# Altium schematic sheet FPGA.SchDoc
size A3
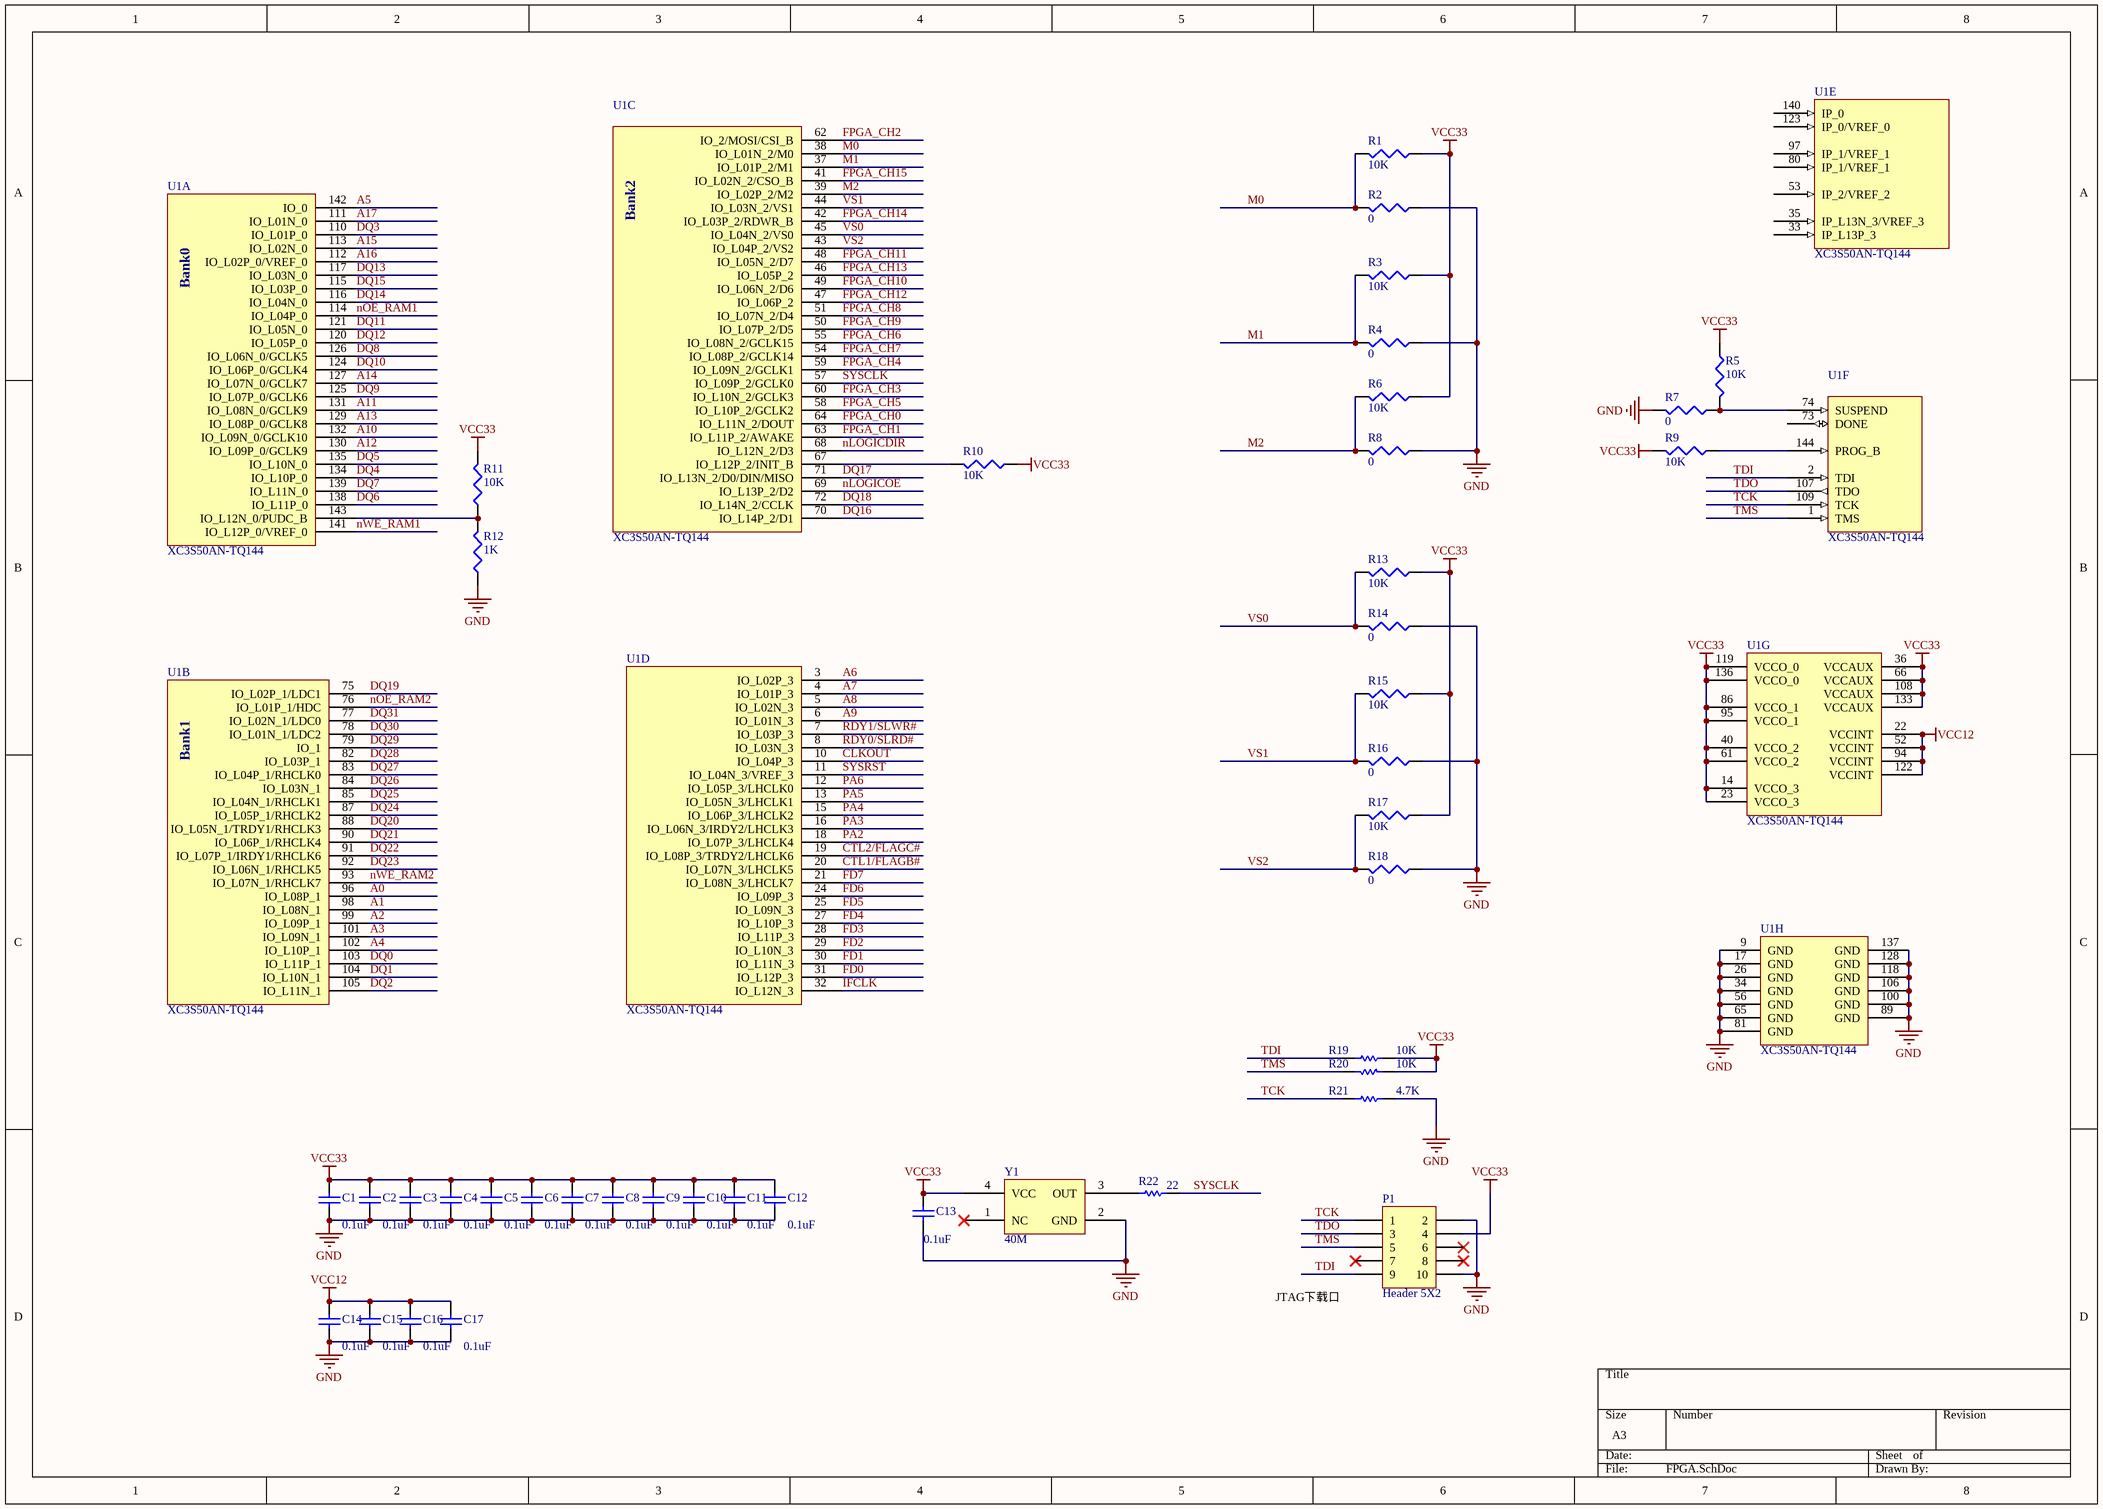
[diagram p0: FPGA.SchDoc]

## Parts
C1  value 0.1uF  [cc0603]
C2  value 0.1uF  [cc0603]
C3  value 0.1uF  [cc0603]
C4  value 0.1uF  [cc0603]
C5  value 0.1uF  [cc0603]
C6  value 0.1uF  [cc0603]
C7  value 0.1uF  [cc0603]
C8  value 0.1uF  [cc0603]
C9  value 0.1uF  [cc0603]
C10  value 0.1uF  [cc0603]
C11  value 0.1uF  [cc0603]
C12  value 0.1uF  [cc0603]
C13  value 0.1uF  [cc0603]
C14  value 0.1uF  [cc0603]
C15  value 0.1uF  [cc0603]
C16  value 0.1uF  [cc0603]
C17  value 0.1uF  [cc0603]
P1  Header 5X2  [HDR2X5]
R1  value 10K  [CR0603]
R2  value 0  [CR0603]
R3  value 10K  [CR0603]
R4  value 0  [CR0603]
R5  value 10K  [CR0603]
R6  value 10K  [CR0603]
R7  value 0  [CR0603]
R8  value 0  [CR0603]
R9  value 10K  [CR0603]
R10  value 10K  [CR0603]
R11  value 10K  [CR0603]
R12  value 1K  [CR0603]
R13  value 10K  [CR0603]
R14  value 0  [CR0603]
R15  value 10K  [CR0603]
R16  value 0  [CR0603]
R17  value 10K  [CR0603]
R18  value 0  [CR0603]
R19  value 10K  [CR0603]  (hidden comment: Res1)
R20  value 10K  [CR0603]  (hidden comment: Res1)
R21  value 4.7K  [CR0603]  (hidden comment: Res1)
R22  value 22  [CR0603]  (hidden comment: Res1)
U1  XC3S50AN-TQ144  [EP2C8T144]  (parts A,B,C,D,E,F,G,H of 8)
Y1  40M  [jing_zhen(you yuan)]

## Nets
GND: C1.1 C2.1 C3.1 C4.1 C5.1 C6.1 C7.1 C8.1 C9.1 C10.1 C11.1 C12.1 C13.1 C14.1 C15.1 C16.1 C17.1 P1.2 P1.10 R2.1 R4.1 R7.2 R8.1 R12.1 R14.1 R16.1 R18.1 R21.1 U1.9(GND) U1.17(GND) U1.26(GND) U1.34(GND) U1.56(GND) U1.65(GND) U1.81(GND) U1.89(GND) U1.100(GND) U1.106(GND) U1.118(GND) U1.128(GND) U1.137(GND) Y1.2(GND)
VCC12: C14.2 C15.2 C16.2 C17.2 U1.22(VCCINT) U1.52(VCCINT) U1.94(VCCINT) U1.122(VCCINT)
VCC33: C1.2 C2.2 C3.2 C4.2 C5.2 C6.2 C7.2 C8.2 C9.2 C10.2 C11.2 C12.2 C13.2 P1.4 R1.1 R3.1 R5.1 R6.1 R9.2 R10.1 R11.2 R13.1 R15.1 R17.1 R19.1 R20.1 U1.14(VCCO_3) U1.23(VCCO_3) U1.36(VCCAUX) U1.40(VCCO_2) U1.61(VCCO_2) U1.66(VCCAUX) U1.86(VCCO_1) U1.95(VCCO_1) U1.108(VCCAUX) U1.119(VCCO_0) U1.133(VCCAUX) U1.136(VCCO_0) Y1.4(VCC)
A0: U1.96(IO_L08P_1)
A1: U1.98(IO_L08N_1)
A2: U1.99(IO_L09P_1)
A3: U1.101(IO_L09N_1)
A4: U1.102(IO_L10P_1)
A5: U1.142(IO_0)
A6: U1.3(IO_L02P_3)
A7: U1.4(IO_L01P_3)
A8: U1.5(IO_L02N_3)
A9: U1.6(IO_L01N_3)
A10: U1.132(IO_L09N_0/GCLK10)
A11: U1.131(IO_L08N_0/GCLK9)
A12: U1.130(IO_L09P_0/GCLK9)
A13: U1.129(IO_L08P_0/GCLK8)
A14: U1.127(IO_L07N_0/GCLK7)
A15: U1.113(IO_L02N_0)
A16: U1.112(IO_L02P_0/VREF_0)
A17: U1.111(IO_L01N_0)
CLKOUT: U1.10(IO_L04P_3)
CTL1/FLAGB#: U1.20(IO_L07N_3/LHCLK5)
CTL2/FLAGC#: U1.19(IO_L08P_3/TRDY2/LHCLK6)
DQ0: U1.103(IO_L11P_1)
DQ1: U1.104(IO_L10N_1)
DQ2: U1.105(IO_L11N_1)
DQ3: U1.110(IO_L01P_0)
DQ4: U1.134(IO_L10P_0)
DQ5: U1.135(IO_L10N_0)
DQ6: U1.138(IO_L11P_0)
DQ7: U1.139(IO_L11N_0)
DQ8: U1.126(IO_L06N_0/GCLK5)
DQ9: U1.125(IO_L07P_0/GCLK6)
DQ10: U1.124(IO_L06P_0/GCLK4)
DQ11: U1.121(IO_L05N_0)
DQ12: U1.120(IO_L05P_0)
DQ13: U1.117(IO_L03N_0)
DQ14: U1.116(IO_L04N_0)
DQ15: U1.115(IO_L03P_0)
DQ16: U1.70(IO_L14P_2/D1)
DQ17: U1.71(IO_L13N_2/D0/DIN/MISO)
DQ18: U1.72(IO_L14N_2/CCLK)
DQ19: U1.75(IO_L02P_1/LDC1)
DQ20: U1.88(IO_L05N_1/TRDY1/RHCLK3)
DQ21: U1.90(IO_L06P_1/RHCLK4)
DQ22: U1.91(IO_L07P_1/IRDY1/RHCLK6)
DQ23: U1.92(IO_L06N_1/RHCLK5)
DQ24: U1.87(IO_L05P_1/RHCLK2)
DQ25: U1.85(IO_L04N_1/RHCLK1)
DQ26: U1.84(IO_L03N_1)
DQ27: U1.83(IO_L04P_1/RHCLK0)
DQ28: U1.82(IO_L03P_1)
DQ29: U1.79(IO_1)
DQ30: U1.78(IO_L01N_1/LDC2)
DQ31: U1.77(IO_L02N_1/LDC0)
FD0: U1.31(IO_L12P_3)
FD1: U1.30(IO_L11N_3)
FD2: U1.29(IO_L10N_3)
FD3: U1.28(IO_L11P_3)
FD4: U1.27(IO_L10P_3)
FD5: U1.25(IO_L09N_3)
FD6: U1.24(IO_L09P_3)
FD7: U1.21(IO_L08N_3/LHCLK7)
FPGA_CH0: U1.64(IO_L11N_2/DOUT)
FPGA_CH1: U1.63(IO_L11P_2/AWAKE)
FPGA_CH2: U1.62(IO_2/MOSI/CSI_B)
FPGA_CH3: U1.60(IO_L10N_2/GCLK3)
FPGA_CH4: U1.59(IO_L09N_2/GCLK1)
FPGA_CH5: U1.58(IO_L10P_2/GCLK2)
FPGA_CH6: U1.55(IO_L08N_2/GCLK15)
FPGA_CH7: U1.54(IO_L08P_2/GCLK14)
FPGA_CH8: U1.51(IO_L07N_2/D4)
FPGA_CH9: U1.50(IO_L07P_2/D5)
FPGA_CH10: U1.49(IO_L06N_2/D6)
FPGA_CH11: U1.48(IO_L05N_2/D7)
FPGA_CH12: U1.47(IO_L06P_2)
FPGA_CH13: U1.46(IO_L05P_2)
FPGA_CH14: U1.42(IO_L03P_2/RDWR_B)
FPGA_CH15: U1.41(IO_L02N_2/CSO_B)
IFCLK: U1.32(IO_L12N_3)
M0: R1.2 R2.2 U1.38(IO_L01N_2/M0)
M1: R3.2 R4.2 U1.37(IO_L01P_2/M1)
M2: R6.2 R8.2 U1.39(IO_L02P_2/M2)
nLOGICDIR: U1.68(IO_L12N_2/D3)
nLOGICOE: U1.69(IO_L13P_2/D2)
nOE_RAM1: U1.114(IO_L04P_0)
nOE_RAM2: U1.76(IO_L01P_1/HDC)
nWE_RAM1: U1.141(IO_L12P_0/VREF_0)
nWE_RAM2: U1.93(IO_L07N_1/RHCLK7)
PA2: U1.18(IO_L07P_3/LHCLK4)
PA3: U1.16(IO_L06N_3/IRDY2/LHCLK3)
PA4: U1.15(IO_L06P_3/LHCLK2)
PA5: U1.13(IO_L05N_3/LHCLK1)
PA6: U1.12(IO_L05P_3/LHCLK0)
RDY0/SLRD#: U1.8(IO_L03N_3)
RDY1/SLWR#: U1.7(IO_L03P_3)
SYSCLK: R22.2 U1.57(IO_L09P_2/GCLK0)
SYSRST: U1.11(IO_L04N_3/VREF_3)
TCK: P1.1 R21.2 U1.109(TCK)
TDI: P1.9 R19.2 U1.2(TDI)
TDO: P1.3 U1.107(TDO)
TMS: P1.5 R20.2 U1.1(TMS)
VS0: R13.2 R14.2 U1.45(IO_L04N_2/VS0)
VS1: R15.2 R16.2 U1.44(IO_L03N_2/VS1)
VS2: R17.2 R18.2 U1.43(IO_L04P_2/VS2)
NetR5_2: R5.2 R7.1 U1.74(SUSPEND)
NetR9_1: R9.1 U1.144(PROG_B)
NetR10_2: R10.2 U1.67(IO_L12P_2/INIT_B)
NetR11_1: R11.1 R12.2 U1.143(IO_L12N_0/PUDC_B)
NetR22_1: R22.1 Y1.3(OUT)

Not connected (* = marked no-connect by the designer): P1 6* 7* 8*; U1 33(IP_L13P_3) 35(IP_L13N_3/VREF_3) 53(IP_2/VREF_2) 73(DONE) 80(IP_1/VREF_1) 97(IP_1/VREF_1) 123(IP_0/VREF_0) 140(IP_0); Y1 1(NC)*

## Notes on the sheet
- (near P1) JTAG下载口
- (in symbol XC3S50AN-5TQ144, part A) Bank0
- (in symbol XC3S50AN-5TQ144, part B) Bank1
- (in symbol XC3S50AN-5TQ144, part C) Bank2

## Library data of the parts
C1-C17 = Cap: Capacitor; Published: 8-Jun-2000; LatestRevisionDate: 17-Jul-2002; LatestRevisionNote: Re-released for DXP Platform.; PackageReference: RAD-0.3; Publisher: Altium Limited
P1 = Header 5X2: Header, 5-Pin, Dual row; Revision: 17-Jul-2002: Re-released for DXP Platform.; Publisher: Altium Limited
R1-R18 = Res3: Resistor; Published: 8-Jun-2000; LatestRevisionDate: 04-Mar-2005; LatestRevisionNote: PCB Footprint replaced.; PackageReference: J1-0603; Publisher: Altium Limited
R19-R22 = Res1: Resistor; Published: 8-Jun-2000; Publisher: Altium Limited
  R19-R21: Revision: July-2002: Re-released for DXP Platform.
  R22: LatestRevisionDate: 17-Jul-2002; LatestRevisionNote: Re-released for DXP Platform.
U1 = XC3S50AN-5TQ144
Y1 = Component_1